# Altium schematic sheet 05021002_PWM - Buzzer and Led.SchDoc: Ipê Board
size A4; Organization: Cerebra SC; Address1: R. Coriolano José Gilbertone; Address2: Jd. Paulista; Address3: n° 703; Address4: São Carlos - Brasil; DocumentNumber: 6; Revision: A; SheetNumber: 6; SheetTotal: 8
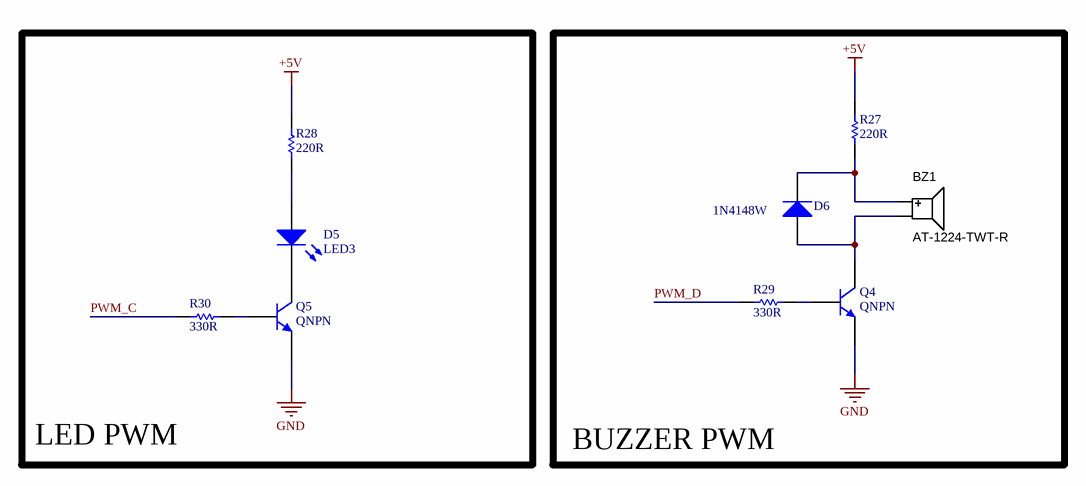
[diagram p0: 05021002_PWM - Buzzer and Led.SchDoc]

## Parts
BZ1  Part Number 1: AT-1224-TWT-R  [BUZZER_12.0X8.5MM]  (hidden comment: 5V BUZZER)
D5  LED3  [LED-0805-K]
D6  1N4148W  [SOD-123]
Q4  QNPN  [SOT-23]
Q5  QNPN  [SOT-23]
R27  220R  [0805]
R28  220R  [0805]
R29  330R  [0805]
R30  330R  [0805]

## Blocks framed on the sheet
LED PWM: D5 Q5 R28 R30
BUZZER PWM: BZ1 D6 Q4 R27 R29

## Nets
+5V: R27.2 R28.2
GND: Q4.3(E) Q5.3(E)
PWM_C: R30.1
PWM_D: R29.1
NetBZ1_1: BZ1.1(Positive) D6.1(K) R27.1
NetBZ1_2: BZ1.2(Negative) D6.2(A) Q4.1(C)
NetD5_1: D5.1(A) R28.1
NetD5_2: D5.2(K) Q5.1(C)
NetQ4_2: Q4.2(B) R29.2
NetQ5_2: Q5.2(B) R30.2

## Notes on the sheet
- Title
- Size:
- Date:
- A4
- Number:
- Time:
- Revision:
- Sheet
- of
- File:

## Library data of the parts
BZ1 = BZ_12x8.5x6.5_2kHz: Speaker, Magnetic Transducer; Manufacturer 1: PUI Audio; SCDType: source; Package / Case: 6.5mm pitch
D5 = LED3: Typical BLUE SiC LED; pin to pad: 1>A 2>K; Manufacturer 1: OSRAM Opto Semiconductors Inc.; Part Number 1: LG R971-KN-1; Published: 8-Jun-2000; LatestRevisionDate: 17-Dec-2003; LatestRevisionNote: PCB Footprint replaced.; DatasheetVersion: 16-Apr-2002; PackageVersion: 16-Apr-2002; PackageReference: 3.5X2.8X1.9; Publisher: Altium Limited; PackageDescription: SM LED; 2 C-Bend Leads; Body 3.5 x 2.8 x 1.9 mm, inc leads (LxWxH typ)
D6 = 1N4148W: Small Signal Fast Switching Diode; Part Number 1: 1N4148W-TP; Manufacturer 1: Micro Commercial Co
Q4 Q5 = QNPN: NPN Bipolar Transistor; Part Number 1: MMBT2222A-7-F; Manufacturer 1: Diodes Incorporated; Published: 8-Jun-2000; LatestRevisionDate: 29-May-2009; LatestRevisionNote: IPC-7351 Footprint Added.; PackageVersion: Aug-1999; PackageReference: SOT-23B; Publisher: Altium Limited; PackageDescription: 3-Pin SOT-23 Package 0.95 mm Pitch, 2.4 mm Lead Span
R27 R28 = resistor_gen: Part Number 1: RMCF0805JT220R; Manufacturer 1: Stackpole Electronics Inc.; Value: 220R
R29 R30 = resistor_gen: Part Number 1: RMCF0805JT330R; Manufacturer 1: Stackpole Electronics Inc.; Value: 330R